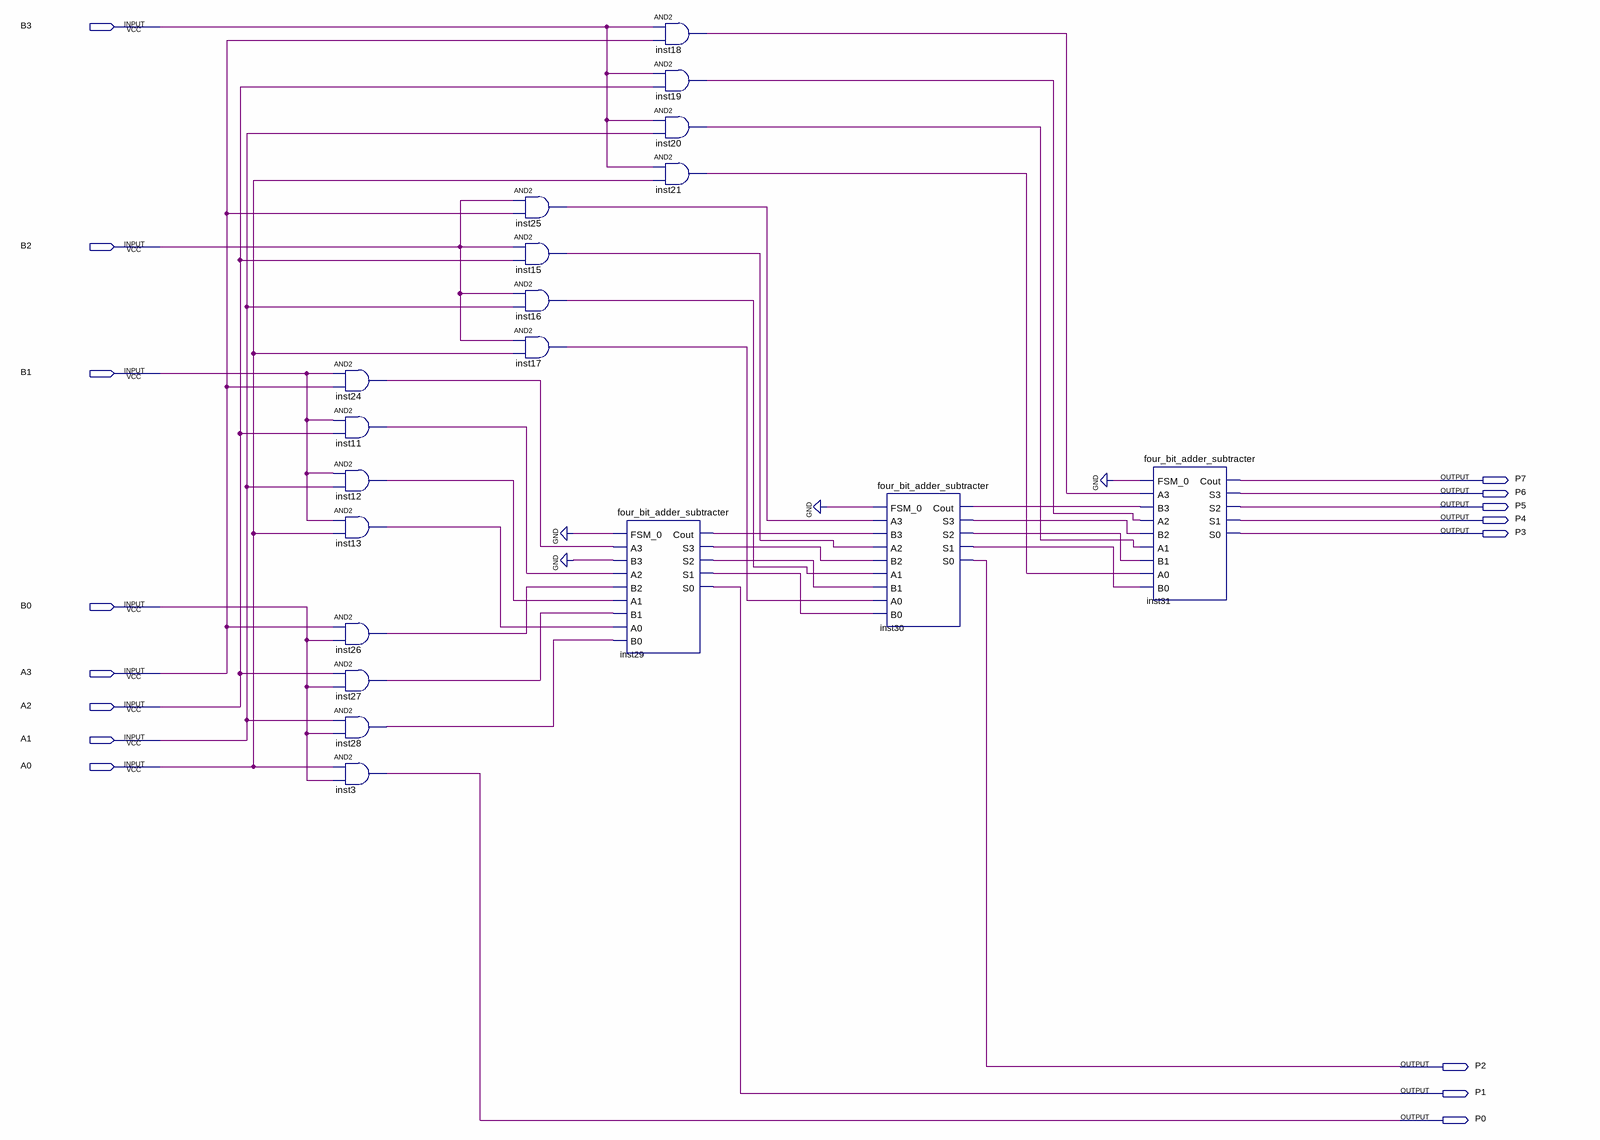
[diagram p0: schematic sheet]
// Quartus schematic four_bit_mulitplier.bdf as structural Verilog: 19 symbols, 16 pins
module four_bit_mulitplier (
  input  B3,
  input  B2,
  input  B1,
  input  B0,
  input  A3,
  input  A2,
  input  A1,
  input  A0,
  output P7,
  output P6,
  output P5,
  output P4,
  output P3,
  output P2,
  output P1,
  output P0
);

  wire inst11_out, inst12_out, inst13_out, inst15_out, inst16_out, inst17_out, inst18_out, inst19_out,
       inst20_out, inst21_out, inst24_out, inst25_out, inst26_out, inst27_out, inst28_out, inst29_cout,
       inst29_s1, inst29_s2, inst29_s3, inst30_cout, inst30_s1, inst30_s2, inst30_s3;

  and inst24 (inst24_out, B1, A3);
  and inst11 (inst11_out, B1, A2);
  and inst12 (inst12_out, B1, A1);
  and inst13 (inst13_out, B1, A0);
  and inst26 (inst26_out, A3, B0);
  and inst27 (inst27_out, A2, B0);
  and inst28 (inst28_out, A1, B0);
  and inst3 (P0, A0, B0);
  and inst25 (inst25_out, B2, A3);
  and inst15 (inst15_out, B2, A2);
  and inst16 (inst16_out, B2, A1);
  and inst17 (inst17_out, B2, A0);
  four_bit_adder_subtracter inst29 (
    .FSM_0(1'b0), .A3(inst24_out), .B3(1'b0), .A2(inst11_out), .B2(inst26_out), .A1(inst12_out),
    .B1(inst27_out), .A0(inst13_out), .B0(inst28_out), .Cout(inst29_cout), .S3(inst29_s3), .S2(inst29_s2),
    .S1(inst29_s1), .S0(P1));
  and inst18 (inst18_out, B3, A3);
  and inst19 (inst19_out, B3, A2);
  and inst20 (inst20_out, B3, A1);
  and inst21 (inst21_out, B3, A0);
  four_bit_adder_subtracter inst30 (
    .FSM_0(1'b0), .A3(inst25_out), .B3(inst29_cout), .A2(inst15_out), .B2(inst29_s3), .A1(inst16_out),
    .B1(inst29_s2), .A0(inst17_out), .B0(inst29_s1), .Cout(inst30_cout), .S3(inst30_s3), .S2(inst30_s2),
    .S1(inst30_s1), .S0(P2));
  four_bit_adder_subtracter inst31 (
    .FSM_0(1'b0), .A3(inst18_out), .B3(inst30_cout), .A2(inst19_out), .B2(inst30_s3), .A1(inst20_out),
    .B1(inst30_s2), .A0(inst21_out), .B0(inst30_s1), .Cout(P7), .S3(P6), .S2(P5), .S1(P4), .S0(P3));
endmodule
